# Altium schematic sheet Input.SchDoc: StepMotor Controller
size A4; Organization: NTUST EE-305; Address1: No.43, Sec. 4, Keelung Rd.; Address2: Da’an Dist.; Address3: Taipei 106; Address4: Taiwan (R.O.C.); DocumentNumber: 6; Revision: 1.0; SheetNumber: 6; SheetTotal: 8
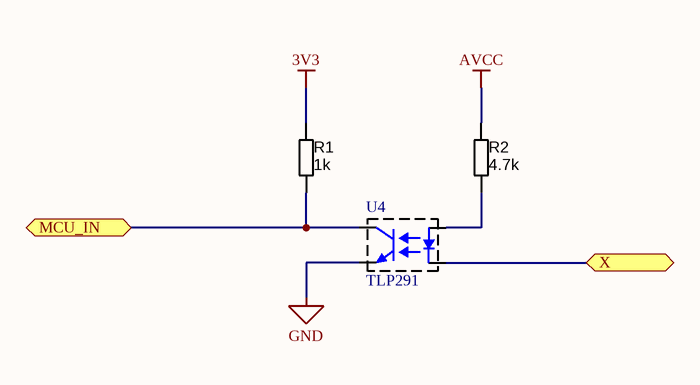
[diagram p0: Input.SchDoc]

## Parts
R1  1k  [RESC1608N]
R2  4.7k  [RESC1608N]
U4  TLP291  [SO4_N]

## Ports
MCU_IN, X

## Nets
3V3: R1.1
AVCC: R2.1
GND: U4.3(EMITTER)
MCU_IN: R1.2 U4.4(COLLECTOR) ; port MCU_IN
X: U4.2(CATHODE) ; port X
NetR2_2: R2.2 U4.1(ANODE)

## Notes on the sheet
- Title
- Name
- Size:
- Revision:
- A4
- Date:
- Time:
- Sheet
- of

## Library data of the parts
R1 R2 = Resistor SMD chip: Manufacturer 1: Yageo; Manufacturer Part Number 1: RC0805JR-0710KL; Ratings: 1/8 W; Tolerance: ?%; Package / Case: 0805 (2012 metric); Material: Thick Film; Supplier 1: Digi-Key; Supplier Part Number 1: 311-10KARCT-ND
  R1: Value: 1k
  R2: Value: 4.7k
U4 = TLP291: Optoisolator Transistor Output 3750Vrms 1 Channel 4-SO